# EAGLE design tv2d (EAGLE 8.1.1)
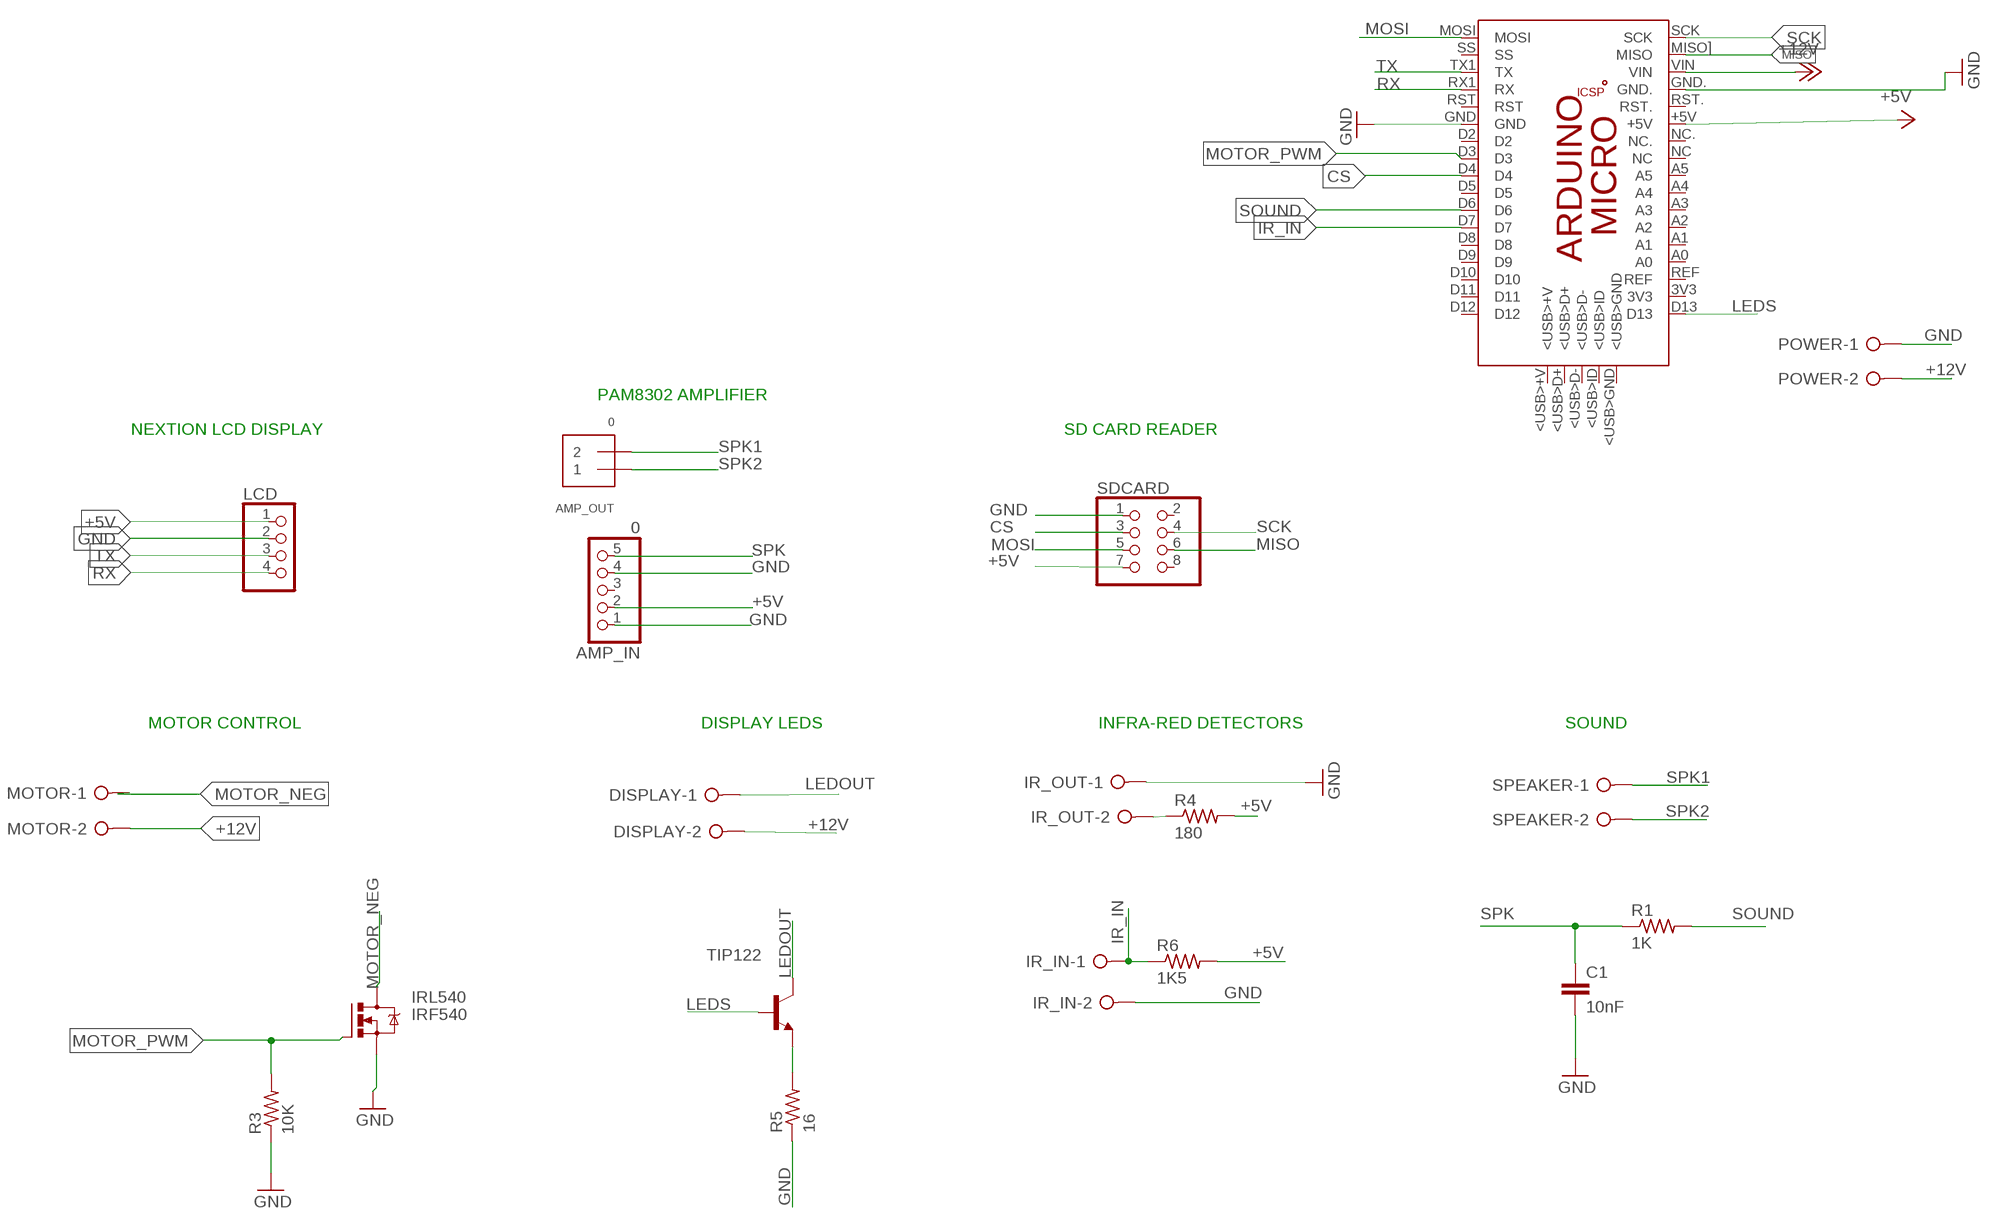
[diagram p0: schematic, sheet 1]

## Parts
AMP_IN  0  HEADER-1X570MIL  [1X05_ROUND_70]
AMP_OUT  0  TERMBLOCK_1X2  [TERMBLOCK_1X2-3.5MM]
C1  10nF  C2.5/2  [C2.5-2]
DISPLAY  W237-02P  [W237-132]
IR_IN  W237-02P  [W237-132]
IR_OUT  W237-02P  [W237-132]
IRL540  IRF540  [TO220BV]
LCD  PINHD-1X4  [1X04]
MOTOR  W237-02P  [W237-132]
PCB1  ARDUINO_MICRO  [ARDUINO_MICRO]
POWER  W237-02P  [W237-132]
R1  1K  R-US_0207/10  [0207/10]
R3  10K  R-US_0207/10  [0207/10]
R4  180  R-US_0207/10  [0207/10]
R5  16  R-US_0207/10  [0207/10]
R6  1K5  R-US_0207/10  [0207/10]
SDCARD  PINHD-2X4  [2X04]
SPEAKER  W237-02P  [W237-132]
TIP122  -NPN-TO220V  [TO220V]

## Nets
+5V: AMP_IN.2 LCD.1 PCB1.+5V R4.2 R6.2 SDCARD.7
+12V: DISPLAY.2 MOTOR.2 PCB1.VIN POWER.2
CS: PCB1.D4 SDCARD.3
GND: AMP_IN.1 AMP_IN.4 C1.2 IR_IN.2 IR_OUT.1 IRL540.S LCD.2 PCB1.GND PCB1.GND. POWER.1 R3.1 R5.1 SDCARD.1
IR_IN: IR_IN.1 PCB1.D7 R6.1
IR_OUT: IR_OUT.2 R4.1
LEDOUT: DISPLAY.1 TIP122.2(C)
LEDS: PCB1.D13 TIP122.1(B)
MISO: PCB1.MISO](MISO) SDCARD.6
MOSI: PCB1.MOSI SDCARD.5
MOTOR_NEG: IRL540.D MOTOR.1
MOTOR_PWM: IRL540.G PCB1.D3 R3.2
N$2: R5.2 TIP122.3(E)
RX: LCD.4 PCB1.RX1(RX)
SCK: PCB1.SCK SDCARD.4
SOUND: PCB1.D6 R1.2
SPK: AMP_IN.5 C1.1 R1.1
SPK1: AMP_OUT.2 SPEAKER.1
SPK2: AMP_OUT.1 SPEAKER.2
TX: LCD.3 PCB1.TX1(TX)
Unconnected: AMP_IN.3 PCB1.3V3 PCB1.5V PCB1.<USB>+V PCB1.<USB>D+ PCB1.<USB>D- PCB1.<USB>GND PCB1.<USB>ID PCB1.A0 PCB1.A1 PCB1.A2 PCB1.A3 PCB1.A4 PCB1.A5 PCB1.D2 PCB1.D5 PCB1.D8 PCB1.D9 PCB1.D10 PCB1.D11 PCB1.D12 PCB1.GND_ PCB1.MISO. PCB1.MOSI. PCB1.NC PCB1.NC. PCB1.REF PCB1.RESET.. PCB1.RST PCB1.RST. PCB1.SCK. PCB1.SS SDCARD.2 SDCARD.8

## Notes on the sheet
- PAM8302 AMPLIFIER
- NEXTION LCD DISPLAY | SD CARD READER
- MOTOR CONTROL | DISPLAY LEDS | INFRA-RED DETECTORS | SOUND

## Library data of the parts
AMP_IN = microbuilder:HEADER-1X5: PIN HEADER
AMP_OUT = microbuilder:TERMBLOCK_1X2: 3.5mm Terminal block http://www.ladyada.net/library/pcb/eaglelibrary.html
C1 = capacitor-wima:C: CAPACITOR naming: grid - package width
DISPLAY IR_IN IR_OUT MOTOR POWER SPEAKER = con-wago-508:W237-02P: WAGO SREW CLAMP; OC_FARNELL: unknown; OC_NEWARK: unknown
IRL540 = transistor-power:IRF540: HEXFET Power MOSFET
LCD = pinhead:PINHD-1X4: PIN HEADER
PCB1 = E14_Arduino_revC 2:ARDUINO_MICRO: Device for representing an Arduino Micro board with a footprint in an EAGLE design. Created by Dave Young for Element14. More EAGLE documentation at: http://www.element14.com/community/community/knode/cadsoft_eagle
R1 R3-R6 = rcl:R-US_: RESISTOR, American symbol
SDCARD = pinhead:PINHD-2X4: PIN HEADER
TIP122 = transistor-neu-to92:*-NPN-: NPN Transistror

## Board
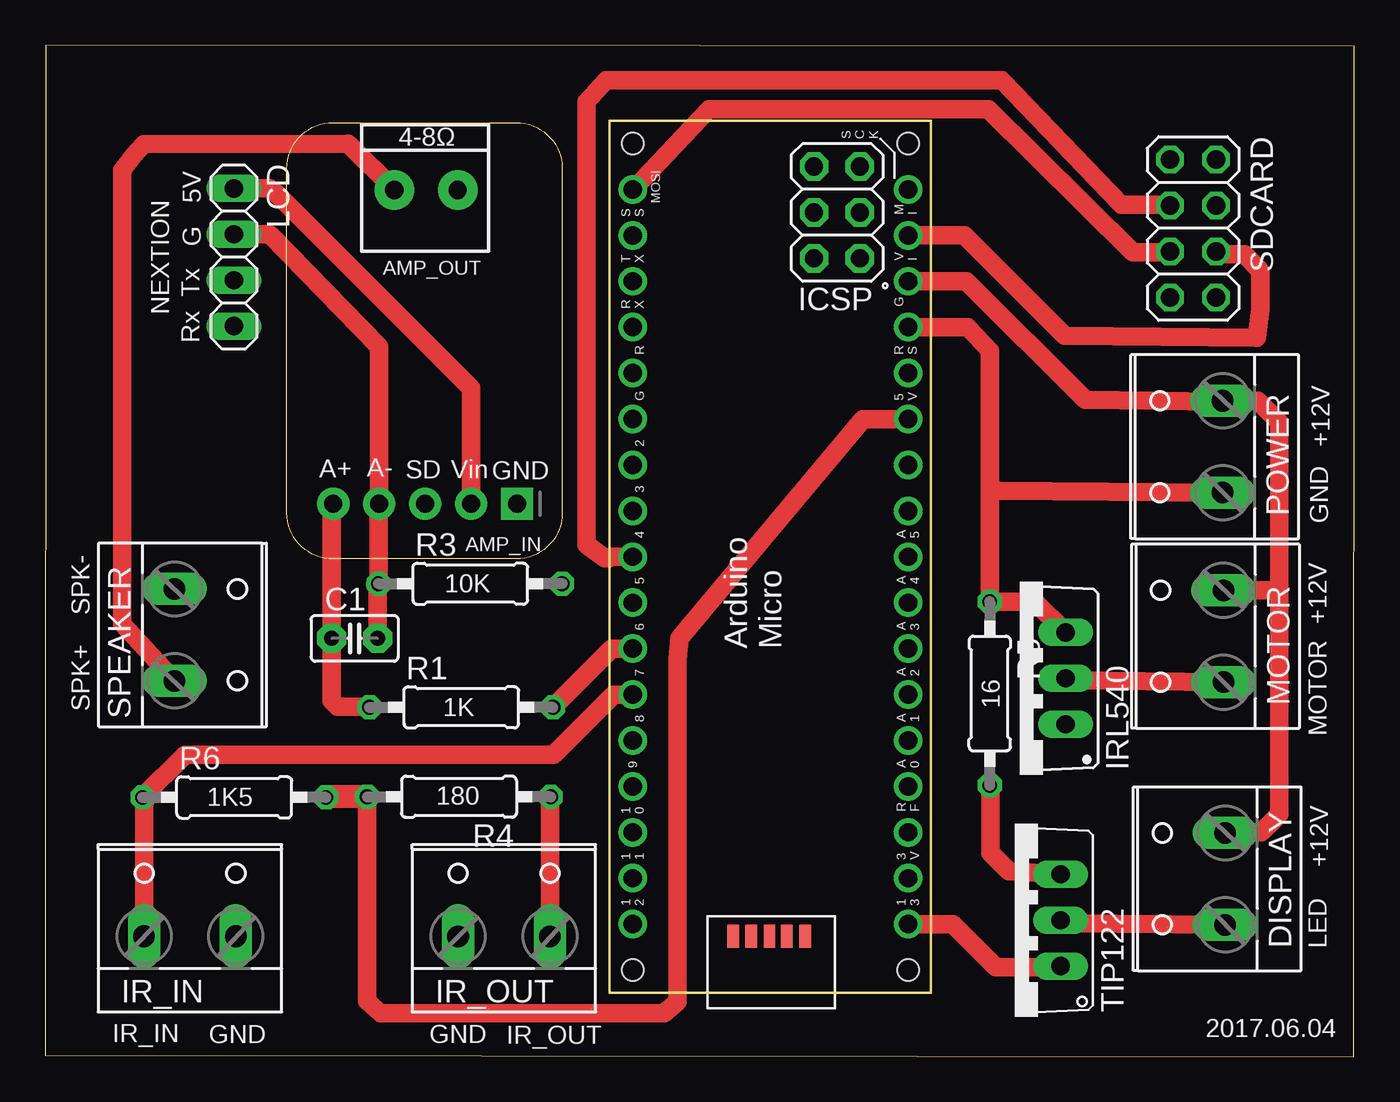
[diagram p1: board, top side]
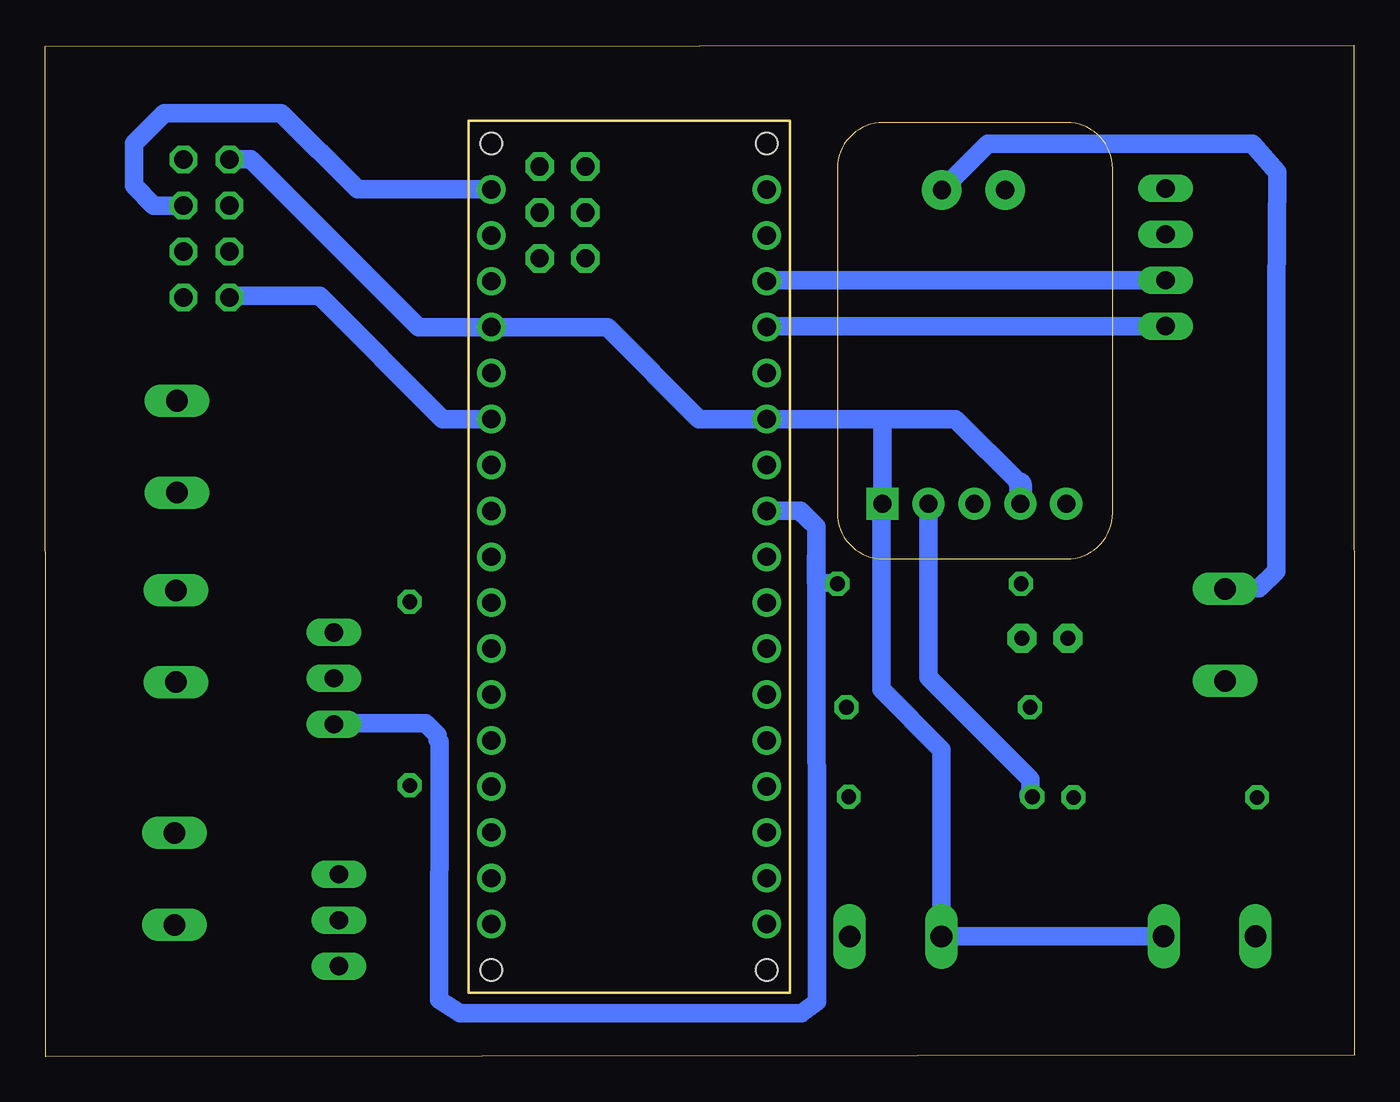
[diagram p2: board, bottom side, seen from below]

Size 72.44 x 55.95 mm. Coordinates in mm from the lower left corner, seen from the top.
Outline: 0,0.07 72.4,0 72.44,55.89 0.02,55.95 0,0.07
Outline: 26.07,27.54 15.91,27.54 arc-90 13.37,30.08 13.37,49.13 arc-90 15.91,51.67 26.07,51.67 arc-90 28.61,49.13 28.61,30.08 arc-90 26.07,27.54
Copper layers (1*16): Top 0.035mm / dielectric 1.5mm / Bottom 0.035mm
Design rules "default *": minimum track width 10mil, minimum drill 24mil, track to track 8mil, track to pad 8mil, pad to pad 8mil, via to via 8mil, smd to smd 8mil, copper to edge 0mil, drill to drill 8mil, minimum pad ring 10mil, minimum via ring 8mil, stop-mask expansion 4mil, vias tented up to drill 0mil, thermal gap 10mil

### Footprints (pad centres in the part's own frame; a part is rotated, then mirrored left to right if it is on the bottom)
1X05_ROUND_70 = drill 1 pad 1.778 square: 1 -5.08,0 | drill 1 pad 1.778: 2 -2.54,0; 3 0,0; 4 2.54,0; 5 5.08,0
TERMBLOCK_1X2-3.5MM = drill 1 pad 2.184: 1 1.8,0; 2 -1.7,0
C2.5-2 = drill 0.813 pad 1.6 octagon: 1 -1.27,0; 2 1.27,0
W237-132 = drill 1.194 long: 1 -2.54,-0.635; 2 2.54,-0.635
TO220BV = drill 1.016 long: D 0,-2.54; G -2.54,-2.54; S 2.54,-2.54
1X04 = drill 1.016 long: 1 -3.81,0; 2 -1.27,0; 3 1.27,0; 4 3.81,0
ARDUINO_MICRO = drill 1.016 pad 1.575: 3V3 6.35,1.27; +5V 31.75,1.27; A0 11.43,1.27; A1 13.97,1.27; A2 16.51,1.27; A3 19.05,1.27; A4 21.59,1.27; A5 24.13,1.27; D2 29.21,16.51; D3 26.67,16.51; D4 24.13,16.51; D5 21.59,16.51; D6 19.05,16.51; D7 16.51,16.51; D8 13.97,16.51; D9 11.43,16.51; D10 8.89,16.51; D11 6.35,16.51; D12 3.81,16.51; D13 3.81,1.27; GND 31.75,16.51; GND. 36.83,1.27; MISO] 41.91,1.27; MOSI 44.45,16.51; NC 26.67,1.27; NC. 29.21,1.27; REF 8.89,1.27; RST 34.29,16.51; RST. 34.29,1.27; RX1 36.83,16.51; SCK 44.45,1.27; SS 41.91,16.51; TX1 39.37,16.51; VIN 39.37,1.27 | drill 1.016 pad 1.575 octagon: 5V 40.64,6.477; GND_ 45.72,6.477; MISO. 40.64,3.937; MOSI. 43.18,6.477; RESET.. 45.72,3.937; SCK. 43.18,3.937 | smd 1.27 x 0.635: <USB>+V 3.15,10.947; <USB>D+ 3.15,9.957; <USB>D- 3.15,8.941; <USB>GND 3.15,6.96; <USB>ID 3.15,7.976 | hole 1.2: 1.27,1.27; 1.27,16.51; 46.99,16.51; 46.99,1.27
0207/10 = drill 0.813 octagon: 1 -5.08,0; 2 5.08,0
2X04 = drill 1.016 octagon: 1 -3.81,-1.27; 2 -3.81,1.27; 3 -1.27,-1.27; 4 -1.27,1.27; 5 1.27,-1.27; 6 1.27,1.27; 7 3.81,-1.27; 8 3.81,1.27
TO220V = drill 1.016 long: 1 -2.54,-2.54; 2 0,-2.54; 3 2.54,-2.54

### Placement (x,y rotation side)
AMP_IN  21.02,30.59 180 top
AMP_OUT  21.12,47.94 180 top
C1  17.12,23.14 0 top
DISPLAY  64.66,9.83 90 top
IR_IN  8.01,7.29 0 top
IR_OUT  25.39,7.29 0 top
IRL540  53.93,20.93 90 top
LCD  10.44,44.22 270 top
MOTOR  64.56,23.25 90 top
PCB1  49.02,3.52 90 top
POWER  64.52,33.74 90 top
R1  23.02,19.32 0 top
R3  23.52,26.16 0 top
R4  22.9,14.37 180 top
R5  52.27,20.08 270 top
R6  10.46,14.34 0 top
SDCARD  63.52,45.81 270 top
SPEAKER  7.79,23.33 270 top
TIP122  53.66,7.55 90 top

### Tracks (layer width: path | path; a pad name or v marks a point on that pad's centre or on a via)
+5V
  Top 1.016: AMP_IN.2 23.56,36.98 12.69,47.85 12.41,48.05 LCD.1 | PCB1.+5V 45.26,35.27 35.09,23.13 34.99,21.95 34.99,3.03 34.24,2.39 18.57,2.39 17.81,3.06 R4.2
  Top 1.27: R6.2 15.57,14.37 R4.2
  Bottom 1.016: AMP_IN.2 23.56,20.99 17.91,15.34 17.91,14.47 | PCB1.+5V 50.44,35.27 57.25,42.09 62.16,42.09 SDCARD.7
  Bottom 1.27: 23.35,30.38 AMP_IN.2 | 17.91,14.47 R4.2
+12V
  Top 1.016: PCB1.VIN 50.99,42.89 57.56,36.32 65.1,36.23 POWER.2 67.09,36.28 68.28,35.09 68.28,26 | 68.28,26 68.28,13.4 67.29,12.4 65.32,12.4 DISPLAY.2 | MOTOR.2 68.07,25.79 68.28,26
CS
  Top 1.016: PCB1.D4 31.3,27.65 31.21,27.57 30.98,27.57 29.96,28.33 29.96,52.83 31.04,54.01 52.95,54.01 59.55,47.14 62.19,47.14 SDCARD.3
GND
  Top 1.016: 18.39,26.11 C1.2 | 18.44,30.55 R3.1 | AMP_IN.4 18.48,39.26 12.44,45.45 12.4,45.49 LCD.2 | PCB1.GND. 51.05,40.35 52.26,39.06 52.26,31.66 | 52.26,31.66 R5.1 54.77,25.16 IRL540.S | POWER.1 52.62,31.3 52.26,31.66
  Top 1.27: R3.1 18.39,26.11 | 18.44,30.55 AMP_IN.4
  Bottom 1.016: 26.19,35.27 22.07,35.27 18.48,31.69 | 26.19,35.27 PCB1.GND 36.26,35.27 41.34,40.35 PCB1.GND. 51.79,40.35 61.08,49.64 62.23,49.64 SDCARD.1 | 26.19,35.27 26.1,35.18 AMP_IN.1 26.18,30.52 26.18,20.32 22.85,16.99 IR_OUT.1 IR_IN.2
  Bottom 1.27: 18.48,31.69 AMP_IN.4
IR_IN
  Top 1.016: 5.47,14.25 IR_IN.1 | PCB1.D7 31.45,20.03 28.12,16.7 7.74,16.7 R6.1
  Top 1.27: R6.1 5.47,14.25
IR_OUT
  Top 1.016: IR_OUT.2 27.93,14.32 R4.1
LEDOUT
  Top 1.016: DISPLAY.1 56.35,7.39 TIP122.2
LEDS
  Top 1.016: PCB1.D13 50.24,7.33 52.62,4.95 56.14,4.95 TIP122.1
MISO
  Top 1.016: PCB1.MISO] 50.87,45.43 56.43,39.87 67.05,39.77 67.25,41.35 67.25,43.48 66.35,44.38 64.95,44.38 SDCARD.6
MOSI
  Top 1.016: PCB1.MOSI 32.56,47.97 36.74,52.4 52.19,52.4 60.19,44.49 62.19,44.49 SDCARD.5
MOTOR_NEG
  Top 1.016: MOTOR.1 56.58,20.81 IRL540.D
MOTOR_PWM
  Bottom 1.016: IRL540.G 56.41,18.44 51.39,18.44 50.73,17.79 50.73,17.54 50.61,17.41 50.64,3.14 49.49,2.39 30.59,2.39 29.73,3.04 29.77,29.3 30.66,30.19 PCB1.D3 30.7,30.17 29.76,29.29 29.79,26.28 29.77,26.21 28.63,26.18 R3.2
N$2
  Top 1.016: TIP122.3 53.33,10.25 52.29,11.29 52.29,14.98 R5.2
RX
  Bottom 1.016: 32.46,40.4 LCD.4
  Bottom 1.27: PCB1.RX1 32.46,40.4
SCK
  Bottom 1.016: PCB1.SCK 55.16,47.97 59.38,52.19 65.86,52.19 67.52,50.52 67.52,48.17 66.43,47.08 SDCARD.4
SOUND
  Top 1.016: PCB1.D6 31.35,22.57 R1.2
SPK
  Top 1.016: 17.91,19.36 16.18,19.36 15.85,19.68 C1.1 15.85,30.5
  Top 1.27: R1.1 17.91,19.36 | AMP_IN.5 15.85,30.5
SPK1
  Bottom 1.016: AMP_OUT.2 20.26,50.5 5.66,50.5 4.25,48.93 4.32,42.1 4.32,26.85 5.29,25.91 SPEAKER.1
SPK2
  Top 1.016: SPEAKER.2 4.27,23.94 4.27,49.03 4.9,49.85 5.44,50.46 16.76,50.5 AMP_OUT.1
TX
  Bottom 1.016: 32.46,42.94 LCD.3
  Bottom 1.27: PCB1.TX1 32.46,42.94

### Text on the board
tPlace: 4-8Ω | 5V | G | Tx | NEXTION | Rx | +12V | A- | A+ | SD | Vin | GND | GND | 10K | SPK- | +12V | 16 | SPK+ | 1K | MOTOR | 1K5 | 180 | +12V | LED | IR_IN | GND | GND | IR_OUT | 2017.06.04